# EAGLE schematic ferrofluide_COUAPEL (EAGLE 7.6.0)
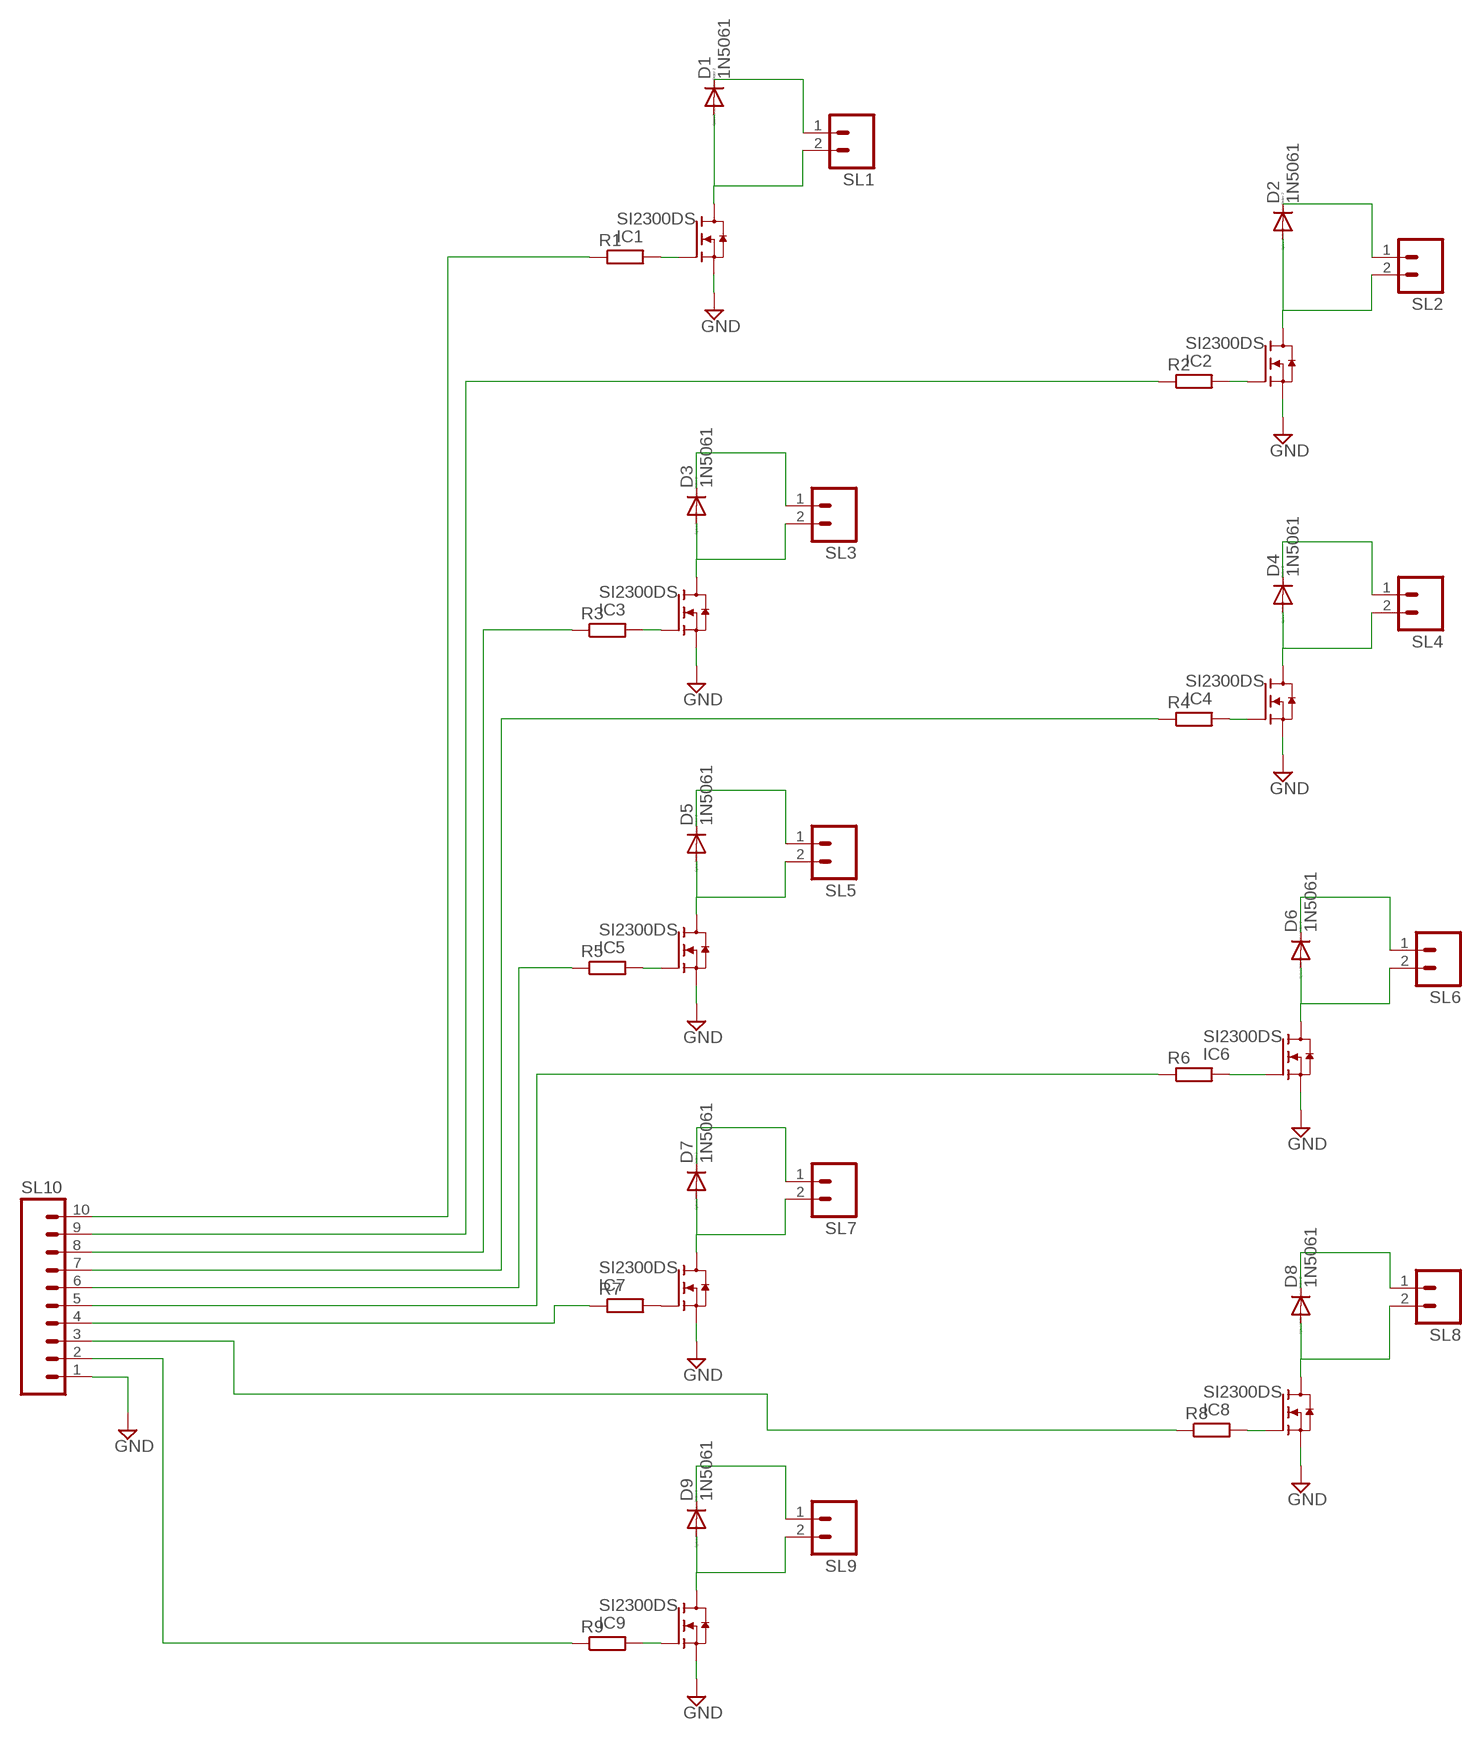
[diagram p0: schematic, sheet 1]

## Parts
D1  1N5061  [SOD57-10]
D2  1N5061  [SOD57-10]
D3  1N5061  [SOD57-10]
D4  1N5061  [SOD57-10]
D5  1N5061  [SOD57-10]
D6  1N5061  [SOD57-10]
D7  1N5061  [SOD57-10]
D8  1N5061  [SOD57-10]
D9  1N5061  [SOD57-10]
IC1  SI2300DS  [SOT23]
IC2  SI2300DS  [SOT23]
IC3  SI2300DS  [SOT23]
IC4  SI2300DS  [SOT23]
IC5  SI2300DS  [SOT23]
IC6  SI2300DS  [SOT23]
IC7  SI2300DS  [SOT23]
IC8  SI2300DS  [SOT23]
IC9  SI2300DS  [SOT23]
R1  R-EU_0207/12  [0207/12]
R2  R-EU_0207/12  [0207/12]
R3  R-EU_0207/12  [0207/12]
R4  R-EU_0207/12  [0207/12]
R5  R-EU_0207/12  [0207/12]
R6  R-EU_0207/12  [0207/12]
R7  R-EU_0207/12  [0207/12]
R8  R-EU_0207/12  [0207/12]
R9  R-EU_0207/12  [0207/12]
SL1  M02  [02P]
SL2  M02  [02P]
SL3  M02  [02P]
SL4  M02  [02P]
SL5  M02  [02P]
SL6  M02  [02P]
SL7  M02  [02P]
SL8  M02  [02P]
SL9  M02  [02P]
SL10  M10  [10P]

## Nets
GND: IC1.2(S) IC2.2(S) IC3.2(S) IC4.2(S) IC5.2(S) IC6.2(S) IC7.2(S) IC8.2(S) IC9.2(S) SL10.1
N$1: D1.C SL1.1
N$2: D1.A IC1.3(D) SL1.2
N$3: IC1.1(G) R1.2
N$4: D2.C SL2.1
N$5: D2.A IC2.3(D) SL2.2
N$6: IC2.1(G) R2.2
N$7: D4.C SL4.1
N$8: D4.A IC4.3(D) SL4.2
N$9: IC4.1(G) R4.2
N$10: D6.C SL6.1
N$11: D6.A IC6.3(D) SL6.2
N$12: IC6.1(G) R6.2
N$13: D8.C SL8.1
N$14: D8.A IC8.3(D) SL8.2
N$15: IC8.1(G) R8.2
N$16: R9.1 SL10.2
N$17: D9.C SL9.1
N$18: D9.A IC9.3(D) SL9.2
N$19: D7.C SL7.1
N$20: IC9.1(G) R9.2
N$21: R8.1 SL10.3
N$22: D7.A IC7.3(D) SL7.2
N$23: IC7.1(G) R7.2
N$24: D5.C SL5.1
N$25: D5.A IC5.3(D) SL5.2
N$26: IC5.1(G) R5.2
N$27: D3.C SL3.1
N$28: D3.A IC3.3(D) SL3.2
N$29: IC3.1(G) R3.2
N$30: R7.1 SL10.4
N$31: R6.1 SL10.5
N$32: R5.1 SL10.6
N$33: R4.1 SL10.7
N$34: R3.1 SL10.8
N$35: R2.1 SL10.9
N$36: R1.1 SL10.10

## Library data of the parts
D1-D9 = diode:1N5061: DIODE controlled avalanche rectifier
IC1-IC9 = linear-eleves:SI2300DS: SOT-23 Single-Supply Centigrade Temperature Sensor Vout = (10mV/°C x Temp °C) +5mmmV Source: http://cache.national.com/ds/LM/LM50.pdf
R1-R9 = resistor:R-EU_: RESISTOR, European symbol
SL1-SL9 = con-amp-quick:M02: AMP QUICK CONNECTOR; OC_FARNELL: unknown; OC_NEWARK: unknown
SL10 = con-amp-quick:M10: AMP QUICK CONNECTOR; OC_FARNELL: unknown; OC_NEWARK: unknown